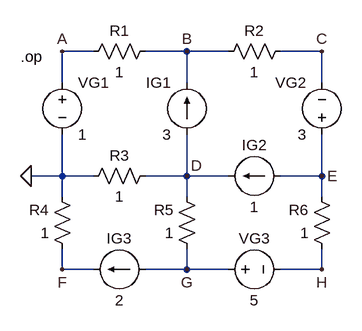
[diagram p0: schematic Draft1.asc]
Draft1.asc, the LTspice schematic file:
Version 4.1
SHEET 1 880 680
WIRE -64 16 -112 16
WIRE 80 16 16 16
WIRE 144 16 80 16
WIRE 288 16 224 16
WIRE -112 64 -112 16
WIRE 80 64 80 16
WIRE 288 64 288 16
WIRE -112 208 -112 144
WIRE -112 208 -160 208
WIRE -64 208 -112 208
WIRE 80 208 80 144
WIRE 80 208 16 208
WIRE 144 208 80 208
WIRE 288 208 288 144
WIRE 288 208 224 208
WIRE -112 240 -112 208
WIRE 80 240 80 208
WIRE 288 240 288 208
WIRE -112 352 -112 320
WIRE -64 352 -112 352
WIRE 80 352 80 320
WIRE 80 352 16 352
WIRE 144 352 80 352
WIRE 288 352 288 320
WIRE 288 352 224 352
FLAG -160 208 0
FLAG -112 16 A
FLAG 80 16 B
FLAG 288 16 C
FLAG 80 208 D
FLAG 288 208 E
FLAG -112 352 F
FLAG 80 352 G
FLAG 288 352 H
SYMBOL voltage -112 48 R0
SYMATTR InstName VG1
SYMATTR Value 1
SYMBOL voltage 288 160 R180
WINDOW 0 24 96 Left 2
WINDOW 3 24 16 Left 2
SYMATTR InstName VG2
SYMATTR Value 3
SYMBOL voltage 128 352 R270
WINDOW 0 32 56 VTop 2
WINDOW 3 -32 56 VBottom 2
SYMATTR InstName VG3
SYMATTR Value 5
SYMBOL res 32 0 R90
WINDOW 0 0 56 VBottom 2
WINDOW 3 32 56 VTop 2
SYMATTR InstName R1
SYMATTR Value 1
SYMBOL res 240 0 R90
WINDOW 0 0 56 VBottom 2
WINDOW 3 32 56 VTop 2
SYMATTR InstName R2
SYMATTR Value 1
SYMBOL res 304 336 R180
WINDOW 0 36 76 Left 2
WINDOW 3 36 40 Left 2
SYMATTR InstName R6
SYMATTR Value 1
SYMBOL res -96 336 R180
WINDOW 0 36 76 Left 2
WINDOW 3 36 40 Left 2
SYMATTR InstName R4
SYMATTR Value 1
SYMBOL res 96 336 R180
WINDOW 0 36 76 Left 2
WINDOW 3 36 40 Left 2
SYMATTR InstName R5
SYMATTR Value 1
SYMBOL res -80 224 R270
WINDOW 0 32 56 VTop 2
WINDOW 3 0 56 VBottom 2
SYMATTR InstName R3
SYMATTR Value 1
SYMBOL current 224 208 R90
WINDOW 0 -32 40 VBottom 2
WINDOW 3 32 40 VTop 2
SYMATTR InstName IG2
SYMATTR Value 1
SYMBOL current 16 352 R90
WINDOW 0 -32 40 VBottom 2
WINDOW 3 32 40 VTop 2
SYMATTR InstName IG3
SYMATTR Value 2
SYMBOL current 80 144 R180
WINDOW 0 24 80 Left 2
WINDOW 3 24 0 Left 2
SYMATTR InstName IG1
SYMATTR Value 3
TEXT -176 24 Left 2 !.op

The netlist it stands for:
* Draft1.asc
VG1 A 0 1
VG2 E C 3
VG3 G H 5
R1 B A 1
R2 C B 1
R6 H E 1
R4 F 0 1
R5 G D 1
R3 0 D 1
IG2 E D 1
IG3 G F 2
IG1 D B 3
.op
.backanno
.end

* Results of the author's LTspice run, read from the files saved beside the schematic
* Operating Point:
*   V(a) = 1 V
*   V(b) = -200 mV
*   V(c) = -4.4 V
*   V(d) = -800 mV
*   V(e) = -1.4 V
*   V(f) = 2 V
*   V(g) = 400 mV
*   V(h) = -4.6 V
*   I(IG1) = 3 A
*   I(IG2) = 1 A
*   I(IG3) = 2 A
*   I(R1) = -1.2 A
*   I(R2) = -4.2 A
*   I(R3) = 800 mA
*   I(R4) = 2 A
*   I(R5) = 1.2 A
*   I(R6) = -3.2 A
*   I(VG1) = -1.2 A
*   I(VG2) = -4.2 A
*   I(VG3) = -3.2 A